# Altium schematic sheet MCU.SchDoc
size A3; SheetNumber: 2; SheetTotal: 8; SPICEModelCacheHYEPGFFD: <root> / <DocumentId>HYEPGFFD</DocumentId> / </root>
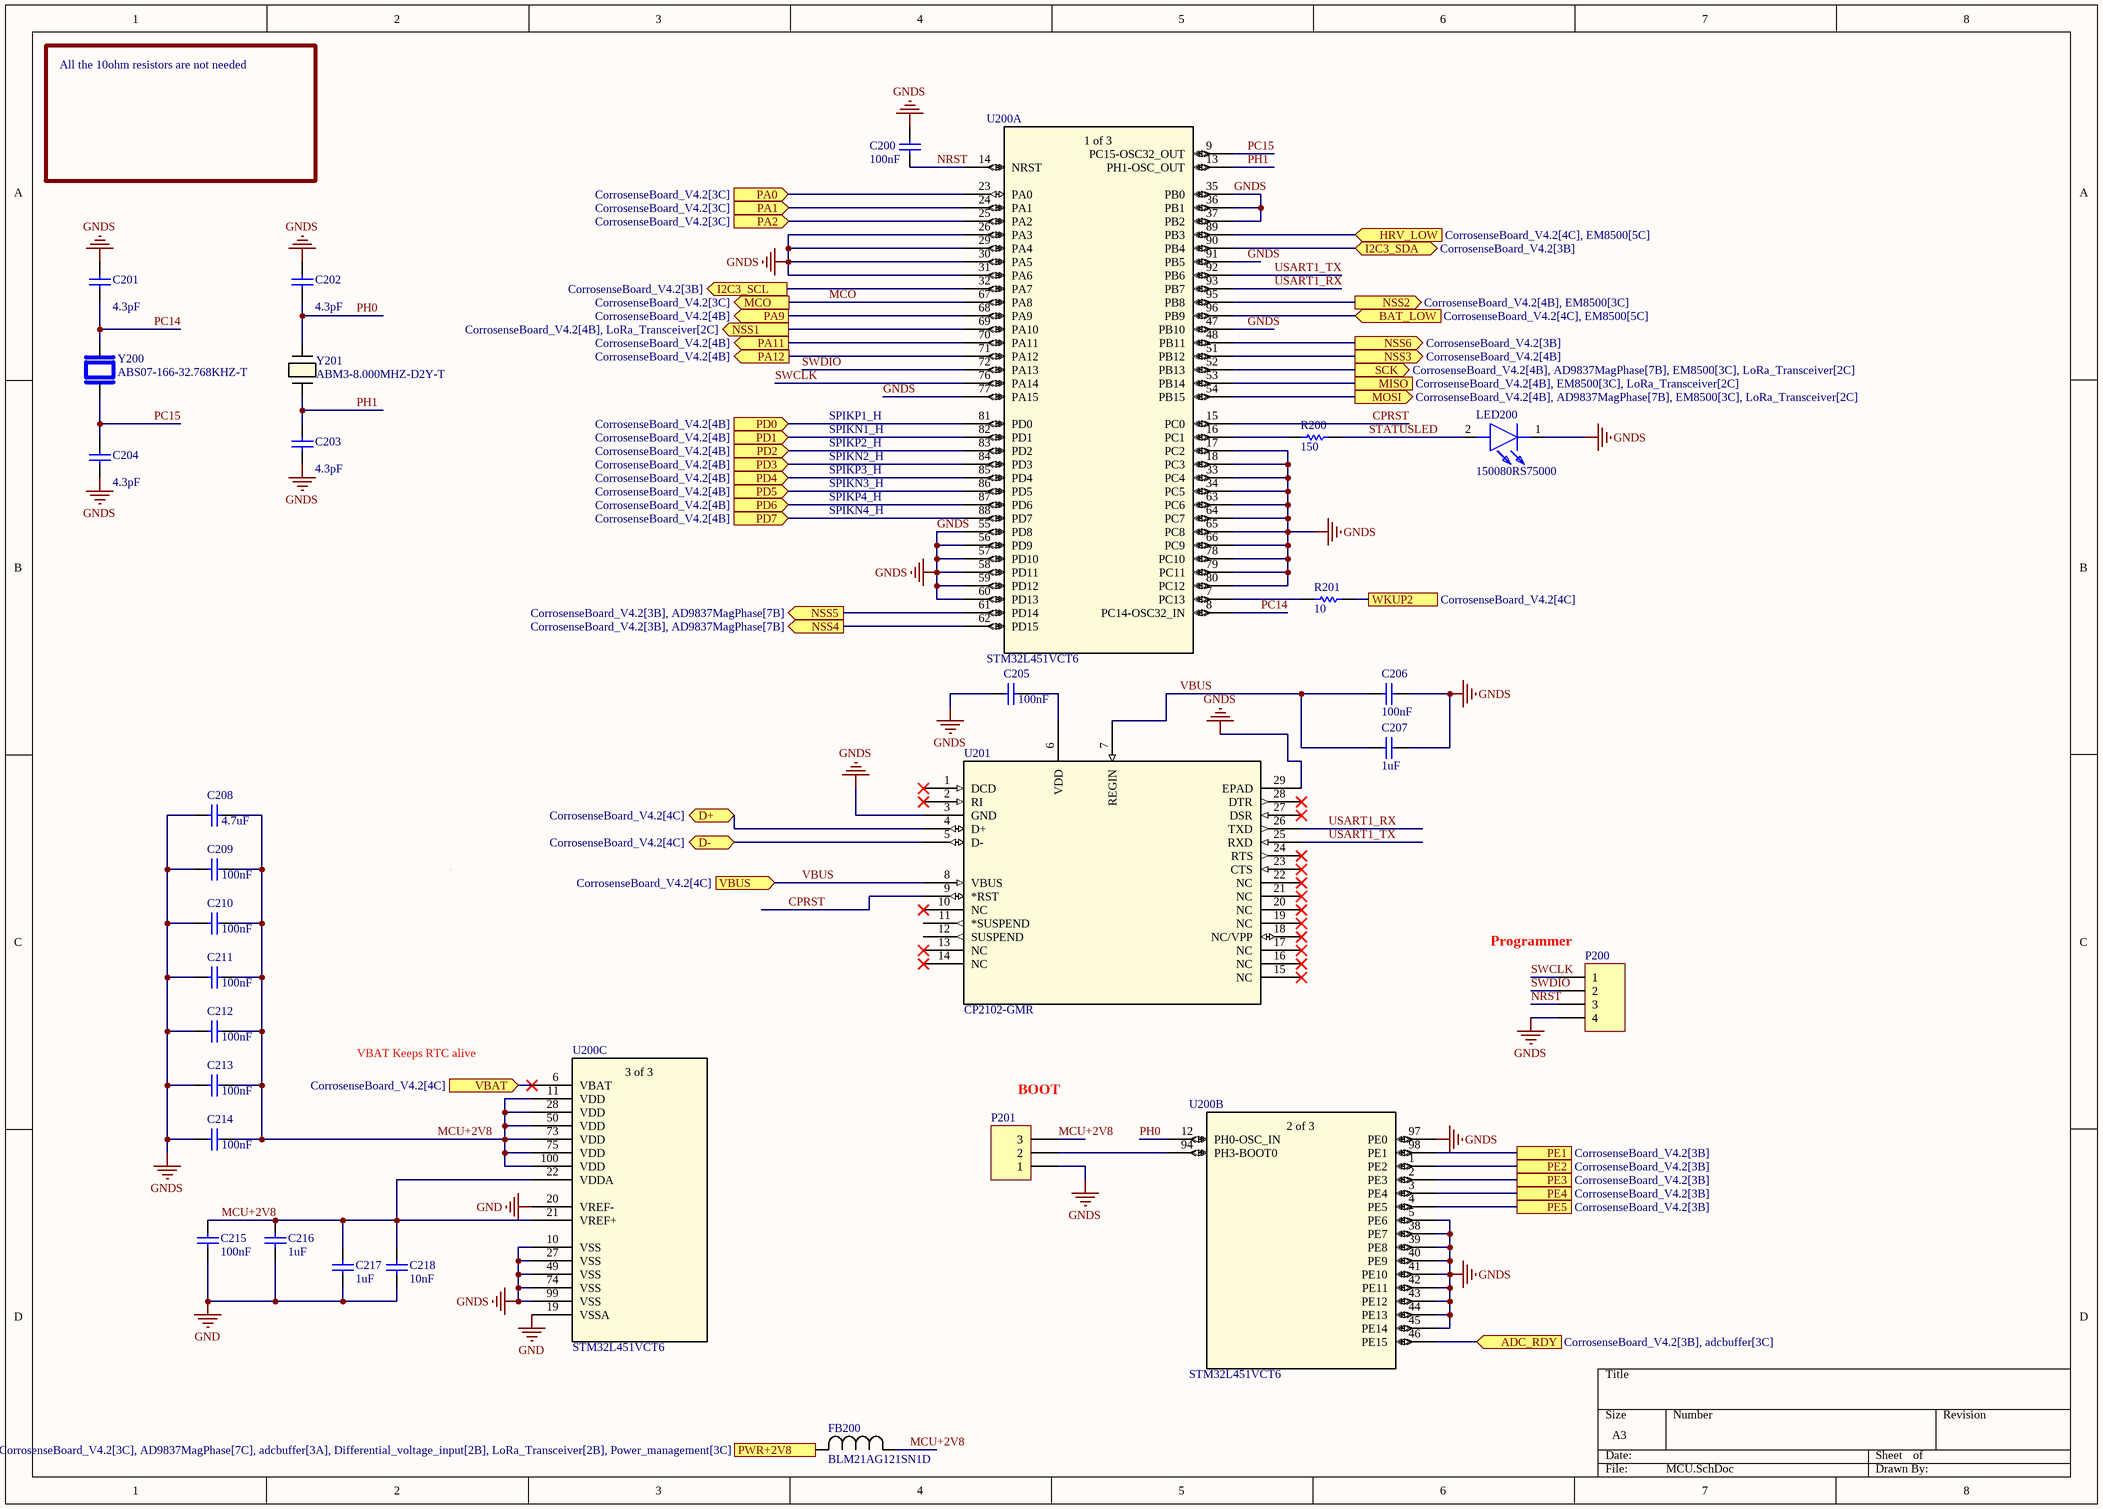
[diagram p0: MCU.SchDoc]

## Parts
C200  100nF  [1608[0603]]
C201  4.3pF  [1608[0603]]
C202  4.3pF  [1608[0603]]
C203  4.3pF  [1608[0603]]
C204  4.3pF  [1608[0603]]
C205  100nF  [1608[0603]]
C206  100nF  [1608[0603]]
C207  1uF  [1608[0603]]
C208  4.7uF  [1608[0603]]
C209  100nF  [1608[0603]]
C210  100nF  [1608[0603]]
C211  100nF  [1608[0603]]
C212  100nF  [1608[0603]]
C213  100nF  [1608[0603]]
C214  100nF  [1608[0603]]
C215  100nF  [1608[0603]]
C216  1uF  [1608[0603]]
C217  1uF  [1608[0603]]
C218  10nF  [1608[0603]]
FB200  BLM21AG121SN1D  [BEADC2012X105N]
LED200  150080RS75000  [LEDC2012X80N]
P200  Header, 4-Pin  [HDR1X4]  (value not drawn)
P201  Header, 3-Pin  [HDR1X3]  (value not drawn)
R200  150  [1608[0603]]
R201  10  [1608[0603]]
U200  STM32L451VCT6  [LQFP100-14x14mm_STM]  (parts A,B,C of 3)
U201  CP2102-GMR  [QFN50P500X500X100-29N-D]
Y200  ABS07-166-32.768KHZ-T  [XTAL_ABS07-166-32.768KHZ-T]
Y201  ABM3-8.000MHZ-D2Y-T  [XTAL_ABM3-8.000MHZ-D2Y-T]

## Ports
ADC_RDY (in, see CorrosenseBoard_V4.2[3B], adcbuffer[3C]), BAT_LOW (in, see CorrosenseBoard_V4.2[4C], EM8500[5C]), D+ (bidir, see CorrosenseBoard_V4.2[4C]), D- (bidir, see CorrosenseBoard_V4.2[4C]), HRV_LOW (in, see CorrosenseBoard_V4.2[4C], EM8500[5C]), I2C3_SCL (out, see CorrosenseBoard_V4.2[3B]), I2C3_SDA (bidir, see CorrosenseBoard_V4.2[3B]), MCO (out, see CorrosenseBoard_V4.2[3C]), MISO (see CorrosenseBoard_V4.2[4B], EM8500[3C], LoRa_Transceiver[2C]), MOSI (out, see CorrosenseBoard_V4.2[4B], AD9837MagPhase[7B], EM8500[3C], LoRa_Transceiver[2C]), NSS1 (out, see CorrosenseBoard_V4.2[4B], LoRa_Transceiver[2C]), NSS2 (out, see CorrosenseBoard_V4.2[4B], EM8500[3C]), NSS3 (out, see CorrosenseBoard_V4.2[4B]), NSS4 (out, see CorrosenseBoard_V4.2[3B], AD9837MagPhase[7B]), NSS5 (out, see CorrosenseBoard_V4.2[3B], AD9837MagPhase[7B]), NSS6 (out, see CorrosenseBoard_V4.2[3B]), PA0 (in, see CorrosenseBoard_V4.2[3C]), PA1 (in, see CorrosenseBoard_V4.2[3C]), PA2 (in, see CorrosenseBoard_V4.2[3C]), PA9 (out, see CorrosenseBoard_V4.2[4B]), PA11 (out, see CorrosenseBoard_V4.2[4B]), PA12 (out, see CorrosenseBoard_V4.2[4B]), PD0 (in, see CorrosenseBoard_V4.2[4B]), PD1 (in, see CorrosenseBoard_V4.2[4B]), PD2 (in, see CorrosenseBoard_V4.2[4B]), PD3 (in, see CorrosenseBoard_V4.2[4B]), PD4 (in, see CorrosenseBoard_V4.2[4B]), PD5 (in, see CorrosenseBoard_V4.2[4B]), PD6 (in, see CorrosenseBoard_V4.2[4B]), PD7 (in, see CorrosenseBoard_V4.2[4B]), PE1 (see CorrosenseBoard_V4.2[3B]), PE2 (see CorrosenseBoard_V4.2[3B]), PE3 (see CorrosenseBoard_V4.2[3B]), PE4 (see CorrosenseBoard_V4.2[3B]), PE5 (see CorrosenseBoard_V4.2[3B]), PWR+2V8 (see CorrosenseBoard_V4.2[3C], AD9837MagPhase[7C], adcbuffer[3A], Differential_voltage_input[2B], LoRa_Transceiver[2B], Power_management[3C]), SCK (out, see CorrosenseBoard_V4.2[4B], AD9837MagPhase[7B], EM8500[3C], LoRa_Transceiver[2C]), VBAT (in, see CorrosenseBoard_V4.2[4C]), VBUS (in, see CorrosenseBoard_V4.2[4C]), WKUP2 (see CorrosenseBoard_V4.2[4C])

## Nets
GND: C215.1 C216.1 C217.1 C218.1 U200.19(VSSA) U200.20(VREF-)
GNDS: C200.2 C201.2 C202.2 C203.1 C204.1 C205.1 C206.1 C207.1 C208.1 C209.1 C210.1 C211.1 C212.1 C213.1 C214.1 LED200.1(K) P200.4 P201.1 U200.5(PE6) U200.10(VSS) U200.17(PC2) U200.18(PC3) U200.26(PA3) U200.27(VSS) U200.29(PA4) U200.30(PA5) U200.31(PA6) U200.33(PC4) U200.34(PC5) U200.35(PB0) U200.36(PB1) U200.37(PB2) U200.38(PE7) U200.39(PE8) U200.40(PE9) U200.41(PE10) U200.42(PE11) U200.43(PE12) U200.44(PE13) U200.45(PE14) U200.47(PB10) U200.49(VSS) U200.55(PD8) U200.56(PD9) U200.57(PD10) U200.58(PD11) U200.59(PD12) U200.60(PD13) U200.63(PC6) U200.64(PC7) U200.65(PC8) U200.66(PC9) U200.74(VSS) U200.77(PA15) U200.78(PC10) U200.79(PC11) U200.80(PC12) U200.91(PB5) U200.97(PE0) U200.99(VSS) U201.3(GND) U201.29(EPAD)
ADC_RDY: U200.46(PE15) ; port ADC_RDY
BAT_LOW: U200.96(PB9) ; port BAT_LOW
CPRST: U200.15(PC0) U201.9(*RST)
D+: U201.4(D+) ; port D+
D-: U201.5(D-) ; port D-
HRV_LOW: U200.89(PB3) ; port HRV_LOW
I2C3_SCL: U200.32(PA7) ; port I2C3_SCL
I2C3_SDA: U200.90(PB4) ; port I2C3_SDA
MCO: U200.67(PA8) ; port MCO
MCU+2V8: C208.2 C209.2 C210.2 C211.2 C212.2 C213.2 C214.2 C215.2 C216.2 C217.2 C218.2 FB200.1 P201.3 U200.11(VDD) U200.21(VREF+) U200.22(VDDA) U200.28(VDD) U200.50(VDD) U200.73(VDD) U200.75(VDD) U200.100(VDD)
MISO: U200.53(PB14) ; port MISO
MOSI: U200.54(PB15) ; port MOSI
NRST: C200.1 P200.3 U200.14(NRST)
NSS1: U200.69(PA10) ; port NSS1
NSS2: U200.95(PB8) ; port NSS2
NSS3: U200.51(PB12) ; port NSS3
NSS4: U200.62(PD15) ; port NSS4
NSS5: U200.61(PD14) ; port NSS5
NSS6: U200.48(PB11) ; port NSS6
PA0: U200.23(PA0) ; port PA0
PA1: U200.24(PA1) ; port PA1
PA2: U200.25(PA2) ; port PA2
PA9: U200.68(PA9) ; port PA9
PA11: U200.70(PA11) ; port PA11
PA12: U200.71(PA12) ; port PA12
PC14: C201.1 U200.8(PC14-OSC32_IN) Y200.2
PC15: C204.2 U200.9(PC15-OSC32_OUT) Y200.1
PD0: U200.81(PD0) ; port PD0
PD1: U200.82(PD1) ; port PD1
PD2: U200.83(PD2) ; port PD2
PD3: U200.84(PD3) ; port PD3
PD4: U200.85(PD4) ; port PD4
PD5: U200.86(PD5) ; port PD5
PD6: U200.87(PD6) ; port PD6
PD7: U200.88(PD7) ; port PD7
PE1: U200.98(PE1) ; port PE1
PE2: U200.1(PE2) ; port PE2
PE3: U200.2(PE3) ; port PE3
PE4: U200.3(PE4) ; port PE4
PE5: U200.4(PE5) ; port PE5
PH0: C202.1 U200.12(PH0-OSC_IN) Y201.2
PH1: C203.2 U200.13(PH1-OSC_OUT) Y201.1
PWR+2V8: FB200.2 ; port PWR+2V8
SCK: U200.52(PB13) ; port SCK
STATUSLED: LED200.2(A) R200.2
SWCLK: P200.1 U200.76(PA14)
SWDIO: P200.2 U200.72(PA13)
USART1_RX: U200.93(PB7) U201.26(TXD)
USART1_TX: U200.92(PB6) U201.25(RXD)
VBAT: U200.6(VBAT) ; port VBAT
VBUS: C206.2 C207.2 U201.7(REGIN) U201.8(VBUS) ; port VBUS
WKUP2: R201.1 ; port WKUP2
NetC205_2: C205.2 U201.6(VDD)
NetP201_2: P201.2 U200.94(PH3-BOOT0)
NetR200_1: R200.1 U200.16(PC1)
NetR201_2: R201.2 U200.7(PC13)

Not connected (* = marked no-connect by the designer): U201 1(DCD)* 2(RI)* 10(NC)* 11(*SUSPEND) 12(SUSPEND) 13(NC)* 14(NC)* 15(NC)* 16(NC)* 17(NC)* 18(NC/VPP)* 19(NC)* 20(NC)* 21(NC)* 22(NC)* 23(CTS)* 24(RTS)* 27(DSR)* 28(DTR)*

## Notes on the sheet
- All the 10ohm resistors are not needed
- SPIKP1_H
- SPIKN1_H
- SPIKP2_H
- SPIKN2_H
- SPIKN3_H
- SPIKN4_H
- SPIKP4_H
- SPIKP3_H
- (near P200) Programmer
- (near U200) VBAT Keeps RTC alive
- (near P201) BOOT
- (in symbol STM32L451VCT6, part A) 1 of 3
- (in symbol STM32L451VCT6, part B) 2 of 3
- (in symbol STM32L451VCT6, part C) 3 of 3

## Library data of the parts
C200 C205 C206 C209-C215 = Cap: CAP CER 25V X7R 0603; Manufacturer: Murata Electronics; MPN: GCJ188R71E104KA12D; Tolerance: ±10%; Value: 100nF; Operating Temperature: -55°C ~ 125°C; Package / Case: 0603 (1608 Metric); Temperature Coefficient: X7R; Voltage - Rated: 25V
C201-C204 = Cap: CAP CER 25V X7R 0603; Manufacturer: KYOCERA AVX; MPN: 06035A4R3CAT2A; Tolerance: ±10%; Value: 4.3pF; Operating Temperature: -55°C ~ 125°C; Package / Case: 0603 (1608 Metric); Temperature Coefficient: X7R; Voltage - Rated: 25V
C207 C216 C217 = Cap: CAP CER 25V X7R 0603; Manufacturer: Murata Electronics; MPN: GCM188R71E105KA64D; Tolerance: ±10%; Value: 1uF; Operating Temperature: -55°C ~ 125°C; Package / Case: 0603 (1608 Metric); Temperature Coefficient: X7R; Voltage - Rated: 25V
C208 = Cap: CAP CER 25V X7R 0603; Manufacturer: Murata Electronics; MPN: GRM188R61E475KE11J; Tolerance: ±10%; Value: 4.7uF; Operating Temperature: -55°C ~ 125°C; Package / Case: 0603 (1608 Metric); Temperature Coefficient: X7R; Voltage - Rated: 25V
C218 = Cap: CAP CER 25V X7R 0603; Manufacturer: Murata Electronics; MPN: GCJ188R71E103KA01J; Tolerance: ±10%; Value: 10nF; Operating Temperature: -55°C ~ 125°C; Package / Case: 0603 (1608 Metric); Temperature Coefficient: X7R; Voltage - Rated: 25V
FB200 = BLM21AG121SN1D: No Description Available; Mfr_Name: Murata; Manufacturer: Murata Electronics; MPN: BLM21AG121SN1D
LED200 = 150080RS75000: LED; Manufacturer_Name: Wurth Elektronik; Datasheet Link: https://componentsearchengine.com/Datasheets/2/150080RS75000.pdf; Height: 0.8mm; Manufacturer_Part_Number: 150080RS75000; Mouser Part Number: 710-150080RS75000; Mouser Price/Stock: https://www.mouser.co.uk/ProductDetail/Wurth-Elektronik/150080RS75000?qs=LlUlMxKIyB2jdCo7bnfgew%3D%3D; Manufacturer: Wurth Elektronik; MPN: 150080RS75000
P200 = Header 4: Manufacturer: Wurth Elektronik; MPN: 61300411121; Publisher: Altium Limited
P201 = Header 3: Manufacturer: Mfr.:Wurth Elektronik; MPN: 61300311121; Publisher: Altium Limited
R200 = Res1: 1608[0603]; Manufacturer: YAGEO; MPN: AC0603FR-07150RL; Tolerance: 2%; Power (Watts): 1.5W; MP: -65°C ~ 155°C; Publisher: Altium Limited; Value: 150; Composition: Thick Film; Operating Temperature: -65°C ~ 155°C; Code_JEITA: Thick Film; Package: 0603 (1608 Metric); PackageReference: 1.5W; Published: Altium Limited; Temperature Coefficient: 2%
R201 = Res1: 1608[0603]; Manufacturer: YAGEO; MPN: RC0603FR-0710RL; Tolerance: 2%; Power (Watts): 1.5W; MP: -65°C ~ 155°C; Publisher: Altium Limited; Value: 10; Composition: Thick Film; Operating Temperature: -65°C ~ 155°C; Code_JEITA: Thick Film; Package: 0603 (1608 Metric); PackageReference: 1.5W; Published: Altium Limited; Temperature Coefficient: 2%
U200 = STM32L451VCT6: No Description Available; Mfr_Name: STMicroelectronics; RefDes: RefDes; Type: Type; Manufacturer: STMicroelectronics; MPN: STM32L451VCT6
U201 = CP2102-GMR: No Description Available; Mfr_Name: Silicon Labs; RefDes: RefDes; Type: Type; Manufacturer: Silicon Labs; MPN: CP2102-GMR
Y200 = ABS07-166-32.768KHZ-T: 32.768 kHz Â±10ppm Crystal 7pF 70 kOhms 2-SMD, No Lead; Value: 32768 kHz; MF: Abracon LLC; SnapEDA_Link: https://www.snapeda.com/parts/ABS07-166-32.768KHZ-T/Abracon+LLC/view-part/?ref=snap; Availability: In Stock; Price: None; Check_prices: https://www.snapeda.com/parts/ABS07-166-32.768KHZ-T/Abracon+LLC/view-part/?ref=eda; Purchase-URL: https://pricing.snapeda.com/search/part/ABS07-166-32.768KHZ-T/?ref=eda; Package: SMD-2 Abracon LLC; MP: ABS07-166-32.768KHZ-T; Manufacturer: Abracon LLC; MPN: ABS07-166-32.768KHZ-T
Y201 = ABM3-8.000MHZ-D2Y-T: No Description Available; Mfr_Name: Abracon; Manufacturer: Abracon; MPN: ABM3-8.000MHZ-D2Y-T